# EAGLE schematic Phasenanschnittsteuerung-f-325V-Gleichstrom-Motor_Übersicht_DE (EAGLE 7.4.0)
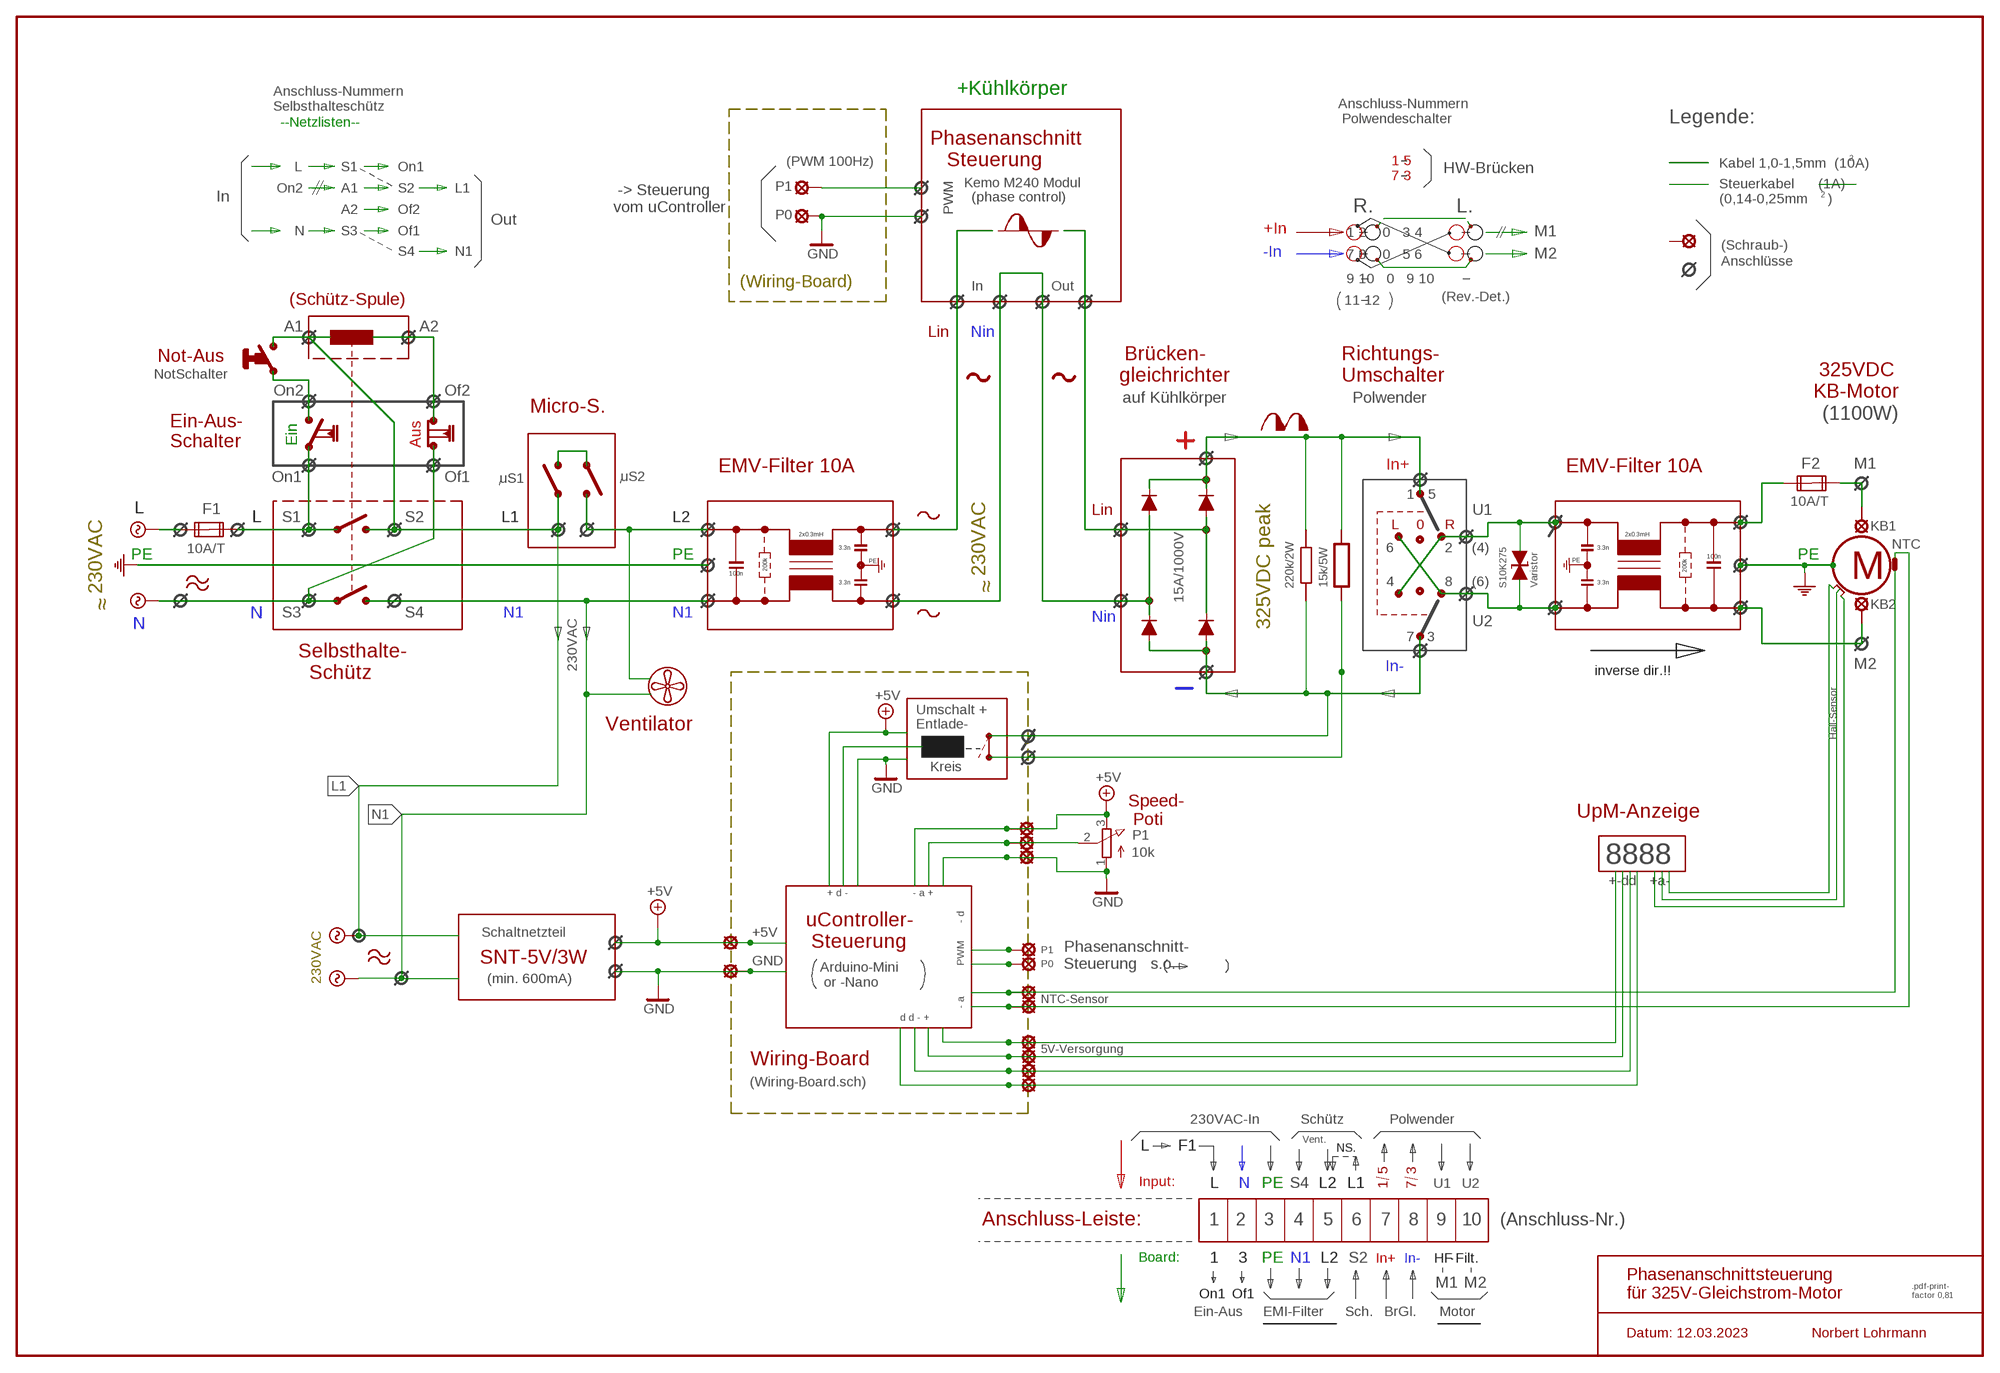
[diagram p0: schematic, sheet 1]

## Parts
D1  DIODE-D-2.5  [D-2.5]
D2  DIODE-D-2.5  [D-2.5]
D3  DIODE-D-2.5  [D-2.5]
D4  DIODE-D-2.5  [D-2.5]
F1  10A/T  FUSE2P  [FUSE1]
F2  10A/T  FUSE2P  [FUSE1]
KB1  LSP10  [LSP10]
KB2  LSP10  [LSP10]
P1  10k  3RP/1610N  [3RP/1610N]
PD1  LSP10  [LSP10]
PD2  LSP10  [LSP10]
PD3  LSP10  [LSP10]
PD4  LSP10  [LSP10]
PD5  LSP10  [LSP10]
PD6  LSP10  [LSP10]
PD9  LSP10  [LSP10]
PD10  LSP10  [LSP10]
PD11  LSP10  [LSP10]
PD12  LSP10  [LSP10]
PD13  LSP10  [LSP10]
PD14  LSP10  [LSP10]
PD15  LSP10  [LSP10]
PD16  LSP10  [LSP10]
PD17  LSP10  [LSP10]
PD18  LSP10  [LSP10]

## Nets
+5V: P1.3(E) PD11.MP PD13.MP PD18.MP
COUT1: D2.C D4.A
COUT2: D1.C D3.A
F2: F2.1A
GND: P1.1(A) PD2.MP PD3.MP PD10.MP PD12.MP PD14.MP
L: F1.2A
M1: F2.2A KB1.MP
M2: KB2.MP
MINUS: D1.A D2.A
N$3: PD17.MP
N$6: PD15.MP
N$16: PD6.MP
N$18: PD5.MP
N$21: PD1.MP
NTC: PD4.MP
PLUS: D3.C D4.C
POTI: P1.2(S) PD9.MP
VE-L: F1.1A ; supply symbol labelled L
Unconnected: F1.1B F1.2B F2.1B F2.2B PD16.MP

## Notes on the sheet
- +Kühlkörper
- Anschluss-Nummern
  Selbsthalteschütz
- Anschluss-Nummern
   Polwendeschalter
- --Netzlisten-- | Legende:
- 2
- (PWM 100Hz)
- Phasenanschnitt
     Steuerung
- L | S1 | On1 | Kabel 1,0-1,5mm  (10A)
- HW-Brücken
- 1 5
  7 3
- P1 | Kemo M240 Modul
- On2 | A1 | S2 | L1
- 2
- In | (phase control)
- Steuerkabel      (1A)
  (0,14-0,25mm
- )
- -> Steuerung
  vom uController
- A2 | Of2 | PWM | R. | L.
- P0
- Out
- N | S3 | Of1 | +In | M1
- S4 | N1 | -In
- 1 2    0   3 4
   7 8    0   5 6
- M2
- (Schraub-)
  Anschlüsse
- (Wiring-Board) | In | Out
- (Schütz-Spule) | 9 10   0   9 10 | 11 12 | (Rev.-Det.)
- A1 | A2
- Lin | Nin
- Not-Aus
- NotSchalter
- Brücken-
  gleichrichter
- Richtungs-
  Umschalter
- On2 | Of2
- 325VDC
  KB-Motor
- auf Kühlkörper | Polwender
- Micro-S.
- (1100W)
- Ein
- Ein-Aus-
  Schalter
- Aus
- EMV-Filter 10A | In+ | EMV-Filter 10A | M1
- On1 | Of1 | uS1 | uS2
- 1 | 5
- L | Lin | U1
- L | S1 | S2 | L1 | L2
- L | 0 | R
- 2x0.3mH | 2x0.3mH
- 3.3n | 6 | 2 | (4) | 3.3n | NTC
- 100n
- PE | PE | 200k | PE
- PE | PE
- 200k
- 100n | 230VAC
- M
- 3.3n | 3.3n
- 220k/2W | 15k/5W | 4 | 8 | (6) | S10K275 | Varistor
- 230VAC | ~ | ~
- 15A/1000V
- ~ | ~
- N | S3 | S4 | N1 | N1 | Nin
- N | 325VDC peak | U2
- 7 | 3
- 230VAC | In- | M2
- inverse dir.!!
- Selbsthalte-
    Schütz
- Umschalt +
- Ventilator | Entlade-
- Hall-Sensor
- Kreis
- UpM-Anzeige
- Speed-
   Poti
- 8888
- +-dd | +a-
- + d - | - a +
- - d
- Schaltnetzteil | +5V
- uController-
   Steuerung
- SNT-5V/3W | GND | PWM
- P1
  P0
- Phasenanschnitt-
  Steuerung   s.o.
- 230VAC | (min. 600mA)
- Arduino-Mini
   or -Nano
- NTC-Sensor
- - a
- d d - +
- 5V-Versorgung
- Wiring-Board
- (Wiring-Board.sch)
- 230VAC-In | Schütz | Polwender
- Vent.
- L | F1 | NS.
- 5 | 3
- Input: | L | N | PE | S4 | L2 | L1 | 1 | 7 | U1 | U2
- Anschluss-Leiste: | 1 | 2 | 3 | 4 | 5 | 6 | 7 | 8 | 9 | 1 | 0 | (Anschluss-Nr.)
- Board: | 1 | 3 | PE | N1 | L2 | S2 | In+ | In- | HF | Filt.
- M1 | M2
- .pdf-print-
  factor 0,81
- On1 | Of1
- Phasenanschnittsteuerung
  für 325V-Gleichstrom-Motor
- Ein-Aus | EMI-Filter | Sch. | BrGl. | Motor
- Datum: 12.03.2023 | Norbert Lohrmann

## Library data of the parts
D1-D4 = diode1:DIODE-: DIODE
F1 F2 = special:FUSE2P: FUSE 5 x 20 mm
KB1 KB2 PD1-PD6 PD9-PD18 = solpad:LSP10: SOLDER PAD drill 1.0 mm, distributor Buerklin, 12H555
P1 = pot:3RP/1610N: 16mm Potentiometer one level Source: http://www.alphapotentiometers.net/html/16mm_pot_2.html